# EAGLE design mjoy_v2 (EAGLE 7.1.0)
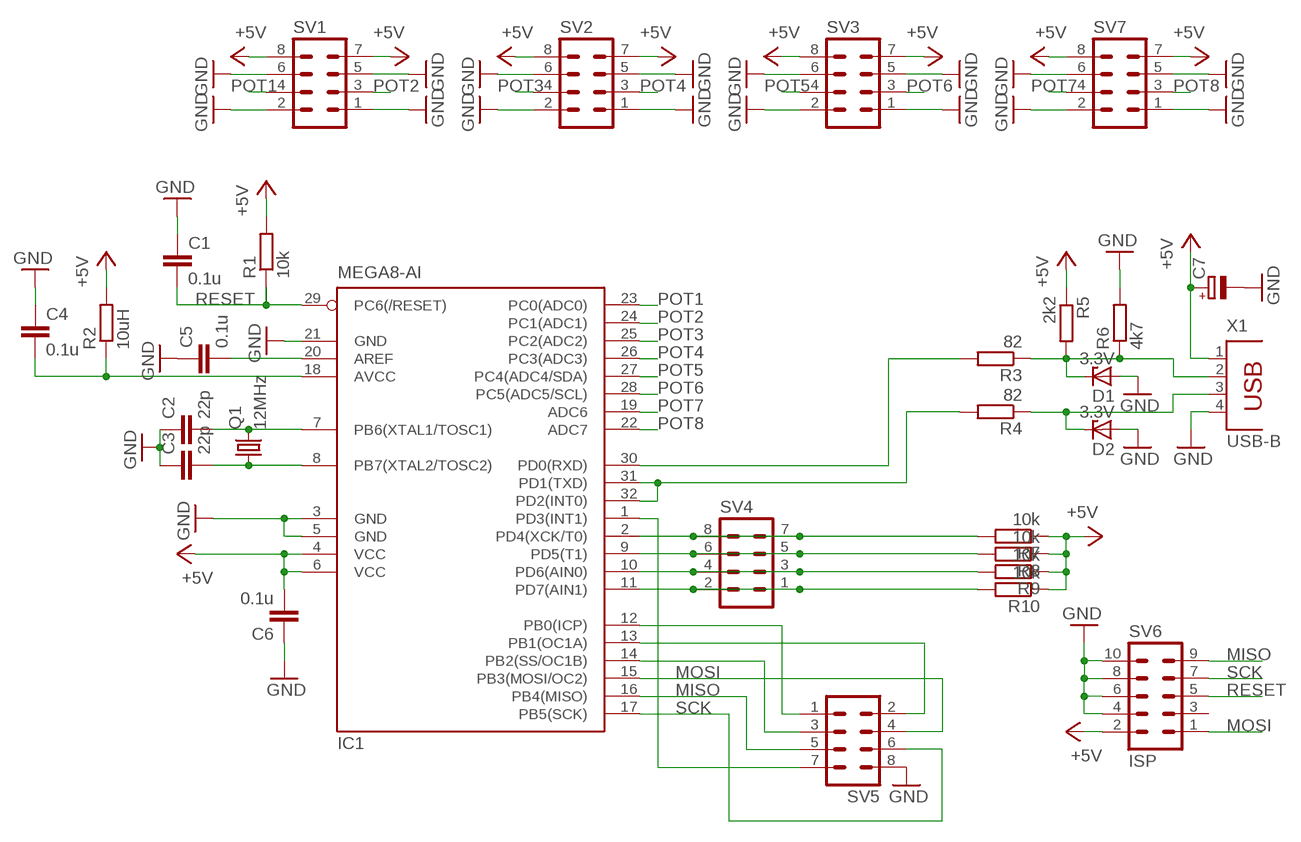
[diagram p0: schematic, sheet 1]

## Parts
C1  0.1u  C-EUC0805  [C0805]
C2  22p  C-EUC0805  [C0805]
C3  22p  C-EUC0805  [C0805]
C4  0.1u  C-EUC0805  [C0805]
C5  0.1u  C-EUC0805  [C0805]
C6  0.1u  C-EUC0805  [C0805]
C7  CPOL-EUSMCD  [SMC_D]
D1  3.3V  ZENER-DIODESOD80C  [SOD80C]
D2  3.3V  ZENER-DIODESOD80C  [SOD80C]
IC1  MEGA8-AI  [TQFP32-08]
Q1  12MHz  CRYSTALHC49UP  [HC49UP]
R1  10k  R-EU_R0805  [R0805]
R2  10uH  R-EU_R1210  [R1210]
R3  82  R-EU_R0805  [R0805]
R4  82  R-EU_R0805  [R0805]
R5  2k2  R-EU_R0805  [R0805]
R6  4k7  R-EU_R0805  [R0805]
R7  10k  R-EU_R0805  [R0805]
R8  10k  R-EU_R0805  [R0805]
R9  10k  R-EU_R0805  [R0805]
R10  10k  R-EU_R0805  [R0805]
SV1  MA04-2  [MA04-2]
SV2  MA04-2  [MA04-2]
SV3  MA04-2  [MA04-2]
SV4  MA04-2  [MA04-2]
SV5  MA04-2  [MA04-2]
SV6  ISP  MA05-2  [MA05-2]
SV7  MA04-2  [MA04-2]
X1  USB-B  PN61729  [PN61729]

## Nets
+5V: C6.2 C7.+ IC1.4(VCC) IC1.6(VCC) R1.2 R2.2 R5.1 R7.1 R8.1 R9.1 R10.1 SV1.7 SV1.8 SV2.7 SV2.8 SV3.7 SV3.8 SV6.2 SV7.7 SV7.8 X1.1
AREF: C5.2 IC1.20(AREF)
GND: C1.1 C2.1 C3.1 C4.1 C5.1 C6.1 C7.- D1.A D2.A IC1.3(GND) IC1.5(GND) IC1.21(GND) R6.2 SV1.1 SV1.2 SV1.5 SV1.6 SV2.1 SV2.2 SV2.5 SV2.6 SV3.1 SV3.2 SV3.5 SV3.6 SV5.8 SV6.4 SV6.6 SV6.8 SV6.10 SV7.1 SV7.2 SV7.5 SV7.6 X1.4
MISO: IC1.16(PB4(MISO)) SV5.5 SV6.9
MOSI: IC1.15(PB3(MOSI/OC2)) SV5.4 SV6.1
N$1: IC1.12(PB0(ICP)) SV5.1
N$2: C4.2 IC1.18(AVCC) R2.1
N$3: IC1.13(PB1(OC1A)) SV5.2
N$4: C3.2 IC1.8(PB7(XTAL2/TOSC2)) Q1.1
N$5: C2.2 IC1.7(PB6(XTAL1/TOSC1)) Q1.2
N$6: IC1.14(PB2(SS/OC1B)) SV5.3
N$15: IC1.30(PD0(RXD)) R3.2
N$16: IC1.31(PD1(TXD)) IC1.32(PD2(INT0)) R4.2
N$17: D1.C R3.1 R5.2 R6.1 X1.2
N$18: D2.C R4.1 X1.3
N$21: IC1.2(PD4(XCK/T0)) R7.2 SV4.7 SV4.8
N$22: IC1.9(PD5(T1)) R8.2 SV4.5 SV4.6
N$23: IC1.10(PD6(AIN0)) R9.2 SV4.3 SV4.4
N$24: IC1.11(PD7(AIN1)) R10.2 SV4.1 SV4.2
N$31: IC1.1(PD3(INT1)) SV5.7
POT1: IC1.23(PC0(ADC0)) SV1.4
POT2: IC1.24(PC1(ADC1)) SV1.3
POT3: IC1.25(PC2(ADC2)) SV2.4
POT4: IC1.26(PC3(ADC3)) SV2.3
POT5: IC1.27(PC4(ADC4/SDA)) SV3.4
POT6: IC1.28(PC5(ADC5/SCL)) SV3.3
POT7: IC1.19(ADC6) SV7.4
POT8: IC1.22(ADC7) SV7.3
RESET: C1.2 IC1.29(PC6(/RESET)) R1.1 SV6.5
SCK: IC1.17(PB5(SCK)) SV5.6 SV6.7
Unconnected: SV6.3

## Library data of the parts
C1-C6 = rcl:C-EU: CAPACITOR, European symbol
C7 = rcl:CPOL-EU: POLARIZED CAPACITOR, European symbol
D1 D2 = diode:ZENER-DIODE: Z-Diode
IC1 = atmel:MEGA8: MICROCONTROLLER 8 Kbytes FLASH, 1 kbytes SRAM, 512 bytes EEPROM, USART, 6-channel 10 bit ADC, 2-channel 8 bit ADC Pin compatible with Atmega48, ATMega88, ATMega168 Source: avr.lbr
Q1 = crystal:CRYSTAL: CRYSTAL
R1-R10 = rcl:R-EU_: RESISTOR, European symbol
SV1-SV5 SV7 = con-lstb:MA04-2: PIN HEADER
SV6 = con-lstb:MA05-2: PIN HEADER
X1 = con-berg:PN61729: BERG USB connector

## Board
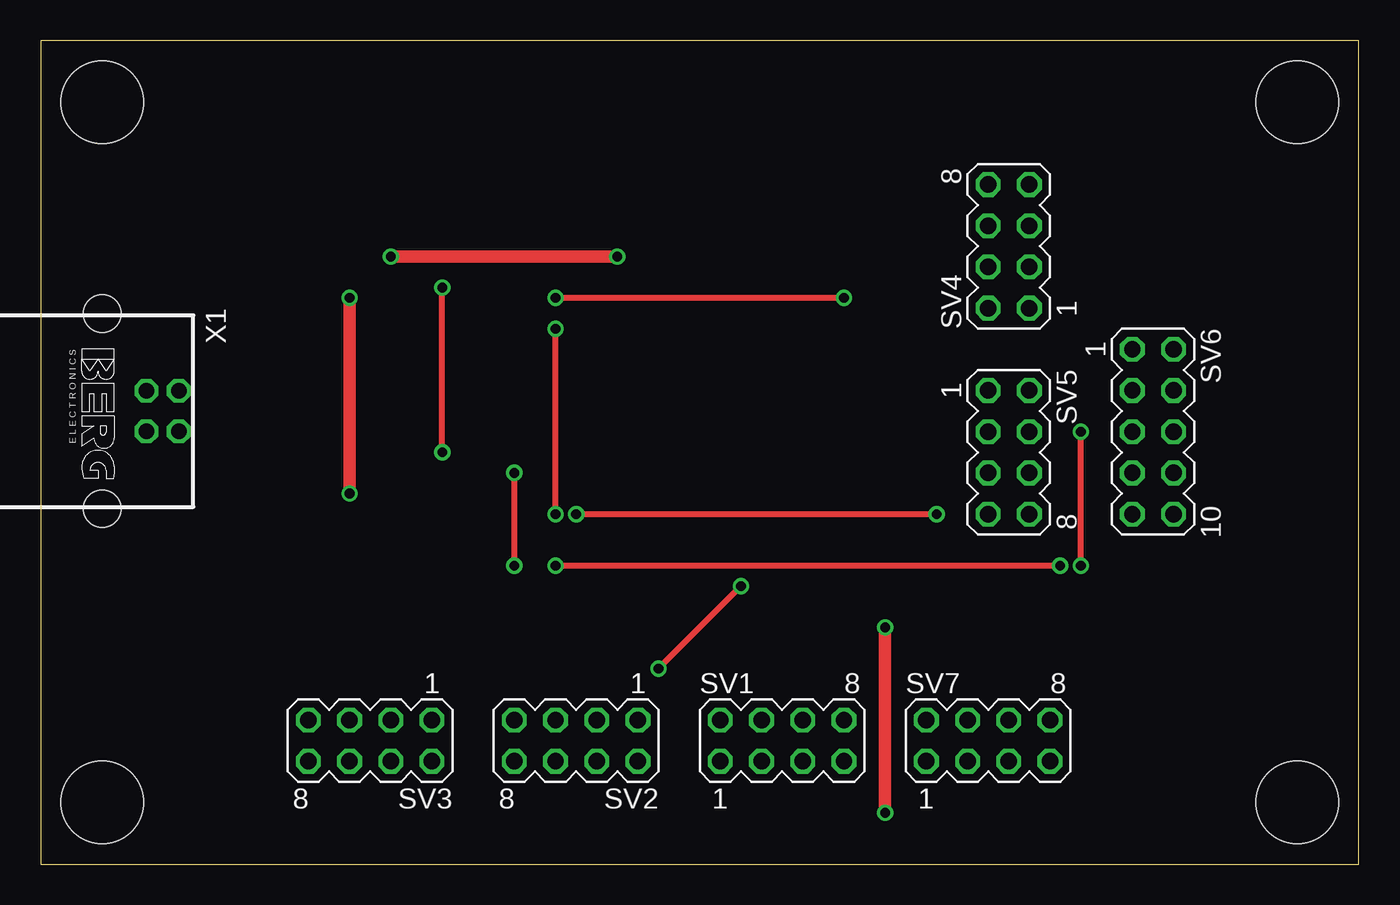
[diagram p1: board, top side]
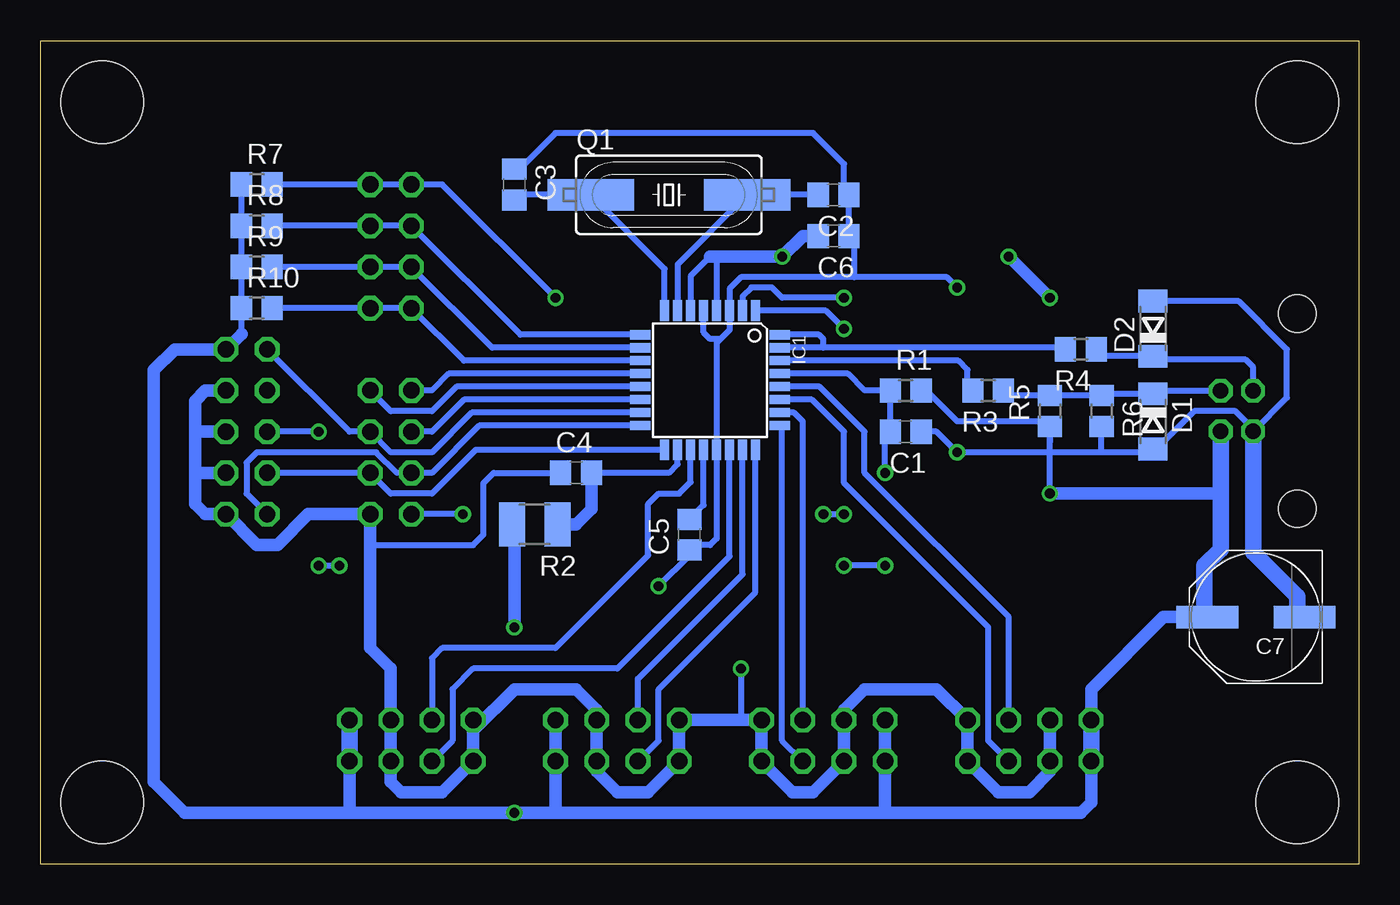
[diagram p2: board, bottom side, seen from below]

Size 81.28 x 50.79 mm. Coordinates in mm from the lower left corner, seen from the top.
Outline: 0,0 81.28,0 81.28,50.79 0,50.79 0,0
Copper layers (1*16): Top 0.035mm / dielectric 1.5mm / Bottom 0.035mm
Design rules "default": minimum track width 10mil, minimum drill 24mil, track to track 8mil, track to pad 8mil, pad to pad 8mil, via to via 8mil, smd to smd 8mil, copper to edge 40mil, drill to drill 8mil, minimum pad ring 10mil, minimum via ring 8mil, stop-mask expansion 4mil, vias tented up to drill 0mil, thermal gap 10mil
Holes 5.08 mm at 3.81,46.99 77.47,46.99 77.47,3.81 3.81,3.81

### Footprints (pad centres in the part's own frame; a part is rotated, then mirrored left to right if it is on the bottom)
C0805 = smd 1.3 x 1.5: 1 -0.95,0; 2 0.95,0
PANASONIC_E = smd 3.8 x 1.4: + 3,0; - -3,0
SOD80C = smd 1.4 x 1.8: A 1.7,0; C -1.7,0
TQFP32-08 = smd 1.27 x 0.559: 1 -4.293,2.8; 2 -4.293,2; 3 -4.293,1.2; 4 -4.293,0.4; 5 -4.293,-0.4; 6 -4.293,-1.2; 7 -4.293,-2; 8 -4.293,-2.8; 17 4.293,-2.8; 18 4.293,-2; 19 4.293,-1.2; 20 4.293,-0.4; 21 4.293,0.4; 22 4.293,1.2; 23 4.293,2; 24 4.293,2.8 | smd 0.559 x 1.27: 9 -2.8,-4.293; 10 -2,-4.293; 11 -1.2,-4.293; 12 -0.4,-4.293; 13 0.4,-4.293; 14 1.2,-4.293; 15 2,-4.293; 16 2.8,-4.293; 25 2.8,4.293; 26 2,4.293; 27 1.2,4.293; 28 0.4,4.293; 29 -0.4,4.293; 30 -1.2,4.293; 31 -2,4.293; 32 -2.8,4.293
HC49UP = smd 5.334 x 1.93: 1 -4.826,0; 2 4.826,0
R0805 = smd 1.3 x 1.5: 1 -0.95,0; 2 0.95,0
R1210 = smd 1.6 x 2.7: 1 -1.4,0; 2 1.4,0
MA04-2 = drill 1.016 octagon: 1 -3.81,-1.27; 2 -3.81,1.27; 3 -1.27,-1.27; 4 -1.27,1.27; 5 1.27,-1.27; 6 1.27,1.27; 7 3.81,-1.27; 8 3.81,1.27
MA05-2 = drill 1.016 octagon: 1 -5.08,-1.27; 2 -5.08,1.27; 3 -2.54,-1.27; 4 -2.54,1.27; 5 0,-1.27; 6 0,1.27; 7 2.54,-1.27; 8 2.54,1.27; 9 5.08,-1.27; 10 5.08,1.27
PN61729 = drill 0.95 octagon: 1 1.25,4.71; 2 -1.25,4.71; 3 -1.25,2.71; 4 1.25,2.71 | hole 2.3: -6.02,0; 6.02,0

### Placement (x,y rotation side)
C1  27.94,26.67 180 bottom
C2  32.38,41.27 180 bottom
C3  52.07,41.91 270 bottom
C4  48.26,24.13 0 bottom
C5  41.27,20.32 90 bottom
C6  32.38,38.73 180 bottom
C7  100u  [PANASONIC_E]  6.35,15.24 180 bottom
D1  12.7,27.3 270 bottom
D2  12.7,33.02 90 bottom
IC1  40.01,29.84 270 bottom
Q1  42.55,41.27 0 bottom
R1  27.94,29.21 0 bottom
R2  50.8,20.95 180 bottom
R3  22.86,29.21 180 bottom
R4  17.14,31.75 180 bottom
R5  19.05,27.94 90 bottom
R6  15.88,27.94 270 bottom
R7  67.94,41.91 0 bottom
R8  67.94,39.37 0 bottom
R9  67.94,36.83 0 bottom
R10  67.94,34.29 0 bottom
SV1  45.72,7.62 0 top
SV2  33.02,7.62 180 top
SV3  20.32,7.62 180 top
SV4  59.69,38.1 90 top
SV5  59.69,25.4 270 top
SV6  68.58,26.67 270 top
SV7  58.42,7.62 0 top
X1  3.81,27.94 270 top

### Tracks (layer width: path | path; a pad name or v marks a point on that pad's centre or on a via)
+5V  (via drill 0.6)
  Top 0.762: v21.59,37.47 v35.56,37.47 | v19.05,22.86 v19.05,34.92 | v52.07,3.17 v52.07,14.61
  Bottom 0.381: R5.1 19.05,26.04 | R1.2 26.67,29.21 24.77,27.3 19.36,27.3 R5.1 | R7.1 R8.1 R9.1 R10.1 68.89,32.7 | 41.27,34.21 IC1.6 41.2,36.27 40.01,37.47 | IC1.4 39.6,37.23 39.37,37.47 | v19.05,22.86 R5.1
  Bottom 0.762: 29.21,3.17 17.14,3.17 16.51,3.81 SV3.7 16.51,10.79 12.06,15.24 C7.+ | 29.21,3.17 49.53,3.17 | SV2.7 SV2.8 29.21,3.17 | SV1.8 SV1.7 49.53,3.17 | 68.89,32.7 SV6.2 73.03,31.75 74.3,30.48 74.3,5.08 72.39,3.17 62.23,3.17 | 62.23,3.17 v52.07,3.17 49.53,3.17 | 40.01,37.47 39.37,37.47 v35.56,37.47 34.29,38.73 C6.2 | 8.52,22.86 v19.05,22.86 | 62.23,3.17 SV7.7 | v52.07,14.61 52.07,20.82 R2.2 | v19.05,34.92 v21.59,37.47
  Bottom 1.016: X1.1 8.52,22.86 8.52,19.42 9.53,18.41 9.53,15.41 C7.+ | SV3.7 SV3.8 | SV7.7 SV7.8
AREF
  Bottom 0.381: IC1.20 40.41,22.14 C5.2
GND  (via drill 0.6)
  Top 0.381: v24.77,25.4 v24.77,35.56 | v43.18,17.14 v38.1,12.06
  Bottom 0.381: D2.A 7.42,34.72 4.45,31.75 4.45,28.77 X1.4 6.5,26.67 6.35,26.67 7.62,27.94 10.16,27.94 12.06,26.04 12.27,26.04 D1.A 12.9,25.4 15.88,25.4 | IC1.5 40.41,32.78 40.01,32.38 39.37,32.38 | 39.37,32.38 38.8,32.95 IC1.3 38.8,35.49 38.1,36.2 31.11,36.2 | 39.37,32.38 39.6,32.15 IC1.21 39.6,20.09 40.01,19.68 40.96,19.68 C5.1 41.27,19.05 v43.18,17.14 | C3.1 51.76,42.86 49.53,45.09 33.66,45.09 31.75,43.18 31.75,41.59 C2.1 C6.1 31.11,38.41 31.11,36.2 | 15.88,25.4 v24.77,25.4 26.04,26.67 C1.1 | 15.88,25.4 R6.2 | v24.77,35.56 25.4,36.2 31.11,36.2 | C4.1 53.34,24.13 53.98,23.5 53.98,20.32 54.61,19.68 60.96,19.68 | v38.1,12.06 38.1,8.89
  Bottom 0.762: SV6.4 71.12,29.21 71.75,28.57 71.75,26.67 | 71.75,24.13 71.75,22.23 71.12,21.59 SV6.10 67.94,19.68 66.67,19.68 64.77,21.59 SV5.8 60.96,19.68 60.96,13.34 59.69,12.06 SV7.6 SV7.5 59.69,5.08 59.05,4.45 56.52,4.45 SV7.1 | 71.75,24.13 71.75,26.67 | 71.75,26.67 SV6.6 | 71.75,24.13 SV6.8 | SV7.1 SV7.2 | SV7.1 54.61,8.26 52.07,10.79 48.26,10.79 46.99,9.53 SV1.6 SV1.5 46.99,5.71 45.72,4.45 43.81,4.45 SV1.1 SV1.2 38.1,8.89 SV2.1 SV2.2 34.92,4.45 33.66,4.45 SV2.6 SV2.5 31.75,9.53 30.48,10.79 26.04,10.79 SV3.1 SV3.2 22.23,4.45 20.32,4.45 19.05,5.71 SV3.5 SV3.6
  Bottom 1.016: X1.4 6.52,19.22 3.81,16.51 3.81,15.7 C7.-
MISO
  Bottom 0.381: IC1.16 54.23,27.05 57.15,24.13 SV5.5 59.31,24.13 60.58,25.4 67.94,25.4 68.58,24.77 68.58,22.86 SV6.9
MOSI
  Bottom 0.381: IC1.15 54.7,27.84 57.15,25.4 59.69,25.4 SV5.4 62.23,26.67 SV6.1
N$1
  Bottom 0.381: IC1.12 56.12,30.25 57.15,29.21 SV5.1
N$2
  Bottom 0.381: IC1.18 42.01,24.67 42.55,24.13 C4.2
  Bottom 0.762: C4.2 47.31,21.91 48.26,20.95 R2.1
N$3
  Bottom 0.381: IC1.13 55.65,29.45 57.15,27.94 59.69,27.94 SV5.2
N$4
  Bottom 0.381: IC1.8 42.8,36.71 Q1.1 | Q1.1 47.3,41.34 | Q1.1 51.76,41.27 C3.2
N$5
  Bottom 0.381: IC1.7 42.01,36.99 Q1.2 | Q1.2 37.78,41.34 | C2.2 Q1.2
N$6
  Bottom 0.381: IC1.14 55.17,28.64 57.15,26.67 SV5.3
N$15
  Bottom 0.381: IC1.30 24.7,31.05 24.13,30.48 24.13,29.53 R3.2
N$16
  Bottom 0.381: 33.02,31.84 18.19,31.84 R4.2 | 33.02,31.84 IC1.31 | IC1.32 33.28,32.65 33.02,32.38 33.02,31.84
N$17
  Bottom 0.381: X1.2 12.52,29.19 D1.C 15.76,29 R6.1 R5.2 21.59,28.89 R3.1
N$18
  Bottom 0.381: X1.3 6.52,30.65 6.99,31.11 12.49,31.11 D2.C 15.77,31.32 R4.1
N$21  (via drill 0.6)
  Top 0.381: v31.75,34.92 v49.53,34.92
  Bottom 0.381: R7.2 SV4.7 SV4.8 56.52,41.91 v49.53,34.92 | IC1.2 38.01,35.02 37.47,35.56 36.2,35.56 35.56,34.92 v31.75,34.92
N$22
  Bottom 0.381: IC1.9 51.7,32.65 SV4.6 SV4.5 R8.2
N$23
  Bottom 0.381: IC1.10 53.44,31.84 SV4.4 SV4.3 R9.2
N$24
  Bottom 0.381: IC1.11 55.17,31.05 SV4.2 SV4.1 R10.2
N$31  (via drill 0.6)
  Top 0.381: v33.02,21.59 v55.24,21.59 | v31.75,21.59 v31.75,33.02
  Bottom 0.381: IC1.1 32.87,34.14 v31.75,33.02 | v55.24,21.59 SV5.7 | v33.02,21.59 v31.75,21.59
POT1
  Bottom 0.381: IC1.23 38.01,17.88 44.45,11.43 SV1.4
POT2
  Bottom 0.381: SV1.3 43.18,7.62 43.18,10.79 37.2,16.77 IC1.24
POT3
  Bottom 0.381: SV2.4 35.56,7.62 35.56,26.89 IC1.25
POT4
  Bottom 0.381: SV2.3 34.29,27.3 34.83,27.84 IC1.26
POT5
  Bottom 0.381: IC1.27 33.73,28.64 31.75,26.67 31.75,23.5 22.86,14.61 22.86,7.62 SV3.4
POT6
  Bottom 0.381: IC1.28 33.26,29.45 30.48,26.67 30.48,24.13 21.59,15.24 SV3.3
POT7
  Bottom 0.381: IC1.19 41.2,23.57 41.91,22.86 43.18,22.86 43.81,22.23 43.81,19.05 49.53,13.34 56.52,13.34 57.15,12.7 SV7.4
POT8
  Bottom 0.381: IC1.22 38.8,18.98 45.72,12.06 54.61,12.06 55.88,10.79 55.88,7.62 SV7.3
RESET  (via drill 0.6)
  Top 0.381: v64.14,18.41 v64.14,26.67 | v31.75,18.41 v62.87,18.41 | v29.21,18.41 v29.21,24.13
  Bottom 0.381: IC1.29 31.52,30.25 30.48,29.21 R1.1 C1.2 29.21,26.35 v29.21,24.13 | v64.14,26.67 SV6.5 | v29.21,18.41 v31.75,18.41 | v64.14,18.41 v62.87,18.41
SCK
  Bottom 0.381: IC1.17 54.46,25.55 57.15,22.86 59.69,22.86 SV5.6 SV6.7